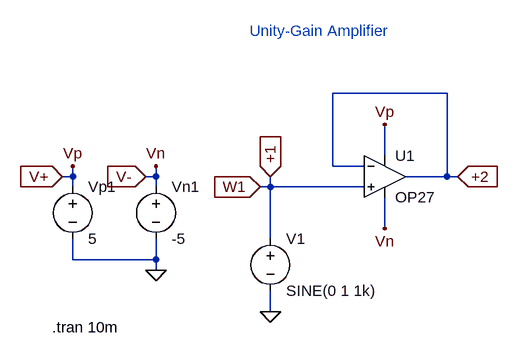
[diagram p0: schematic unity_gain_amp.asc]
unity_gain_amp.asc, the LTspice schematic file:
Version 4
SHEET 1 880 680
WIRE 480 0 304 0
WIRE 384 96 384 48
WIRE 304 112 304 0
WIRE 352 112 304 112
WIRE -96 128 -96 112
WIRE -96 128 -112 128
WIRE 32 128 32 112
WIRE 32 128 16 128
WIRE 480 128 480 0
WIRE 480 128 416 128
WIRE 496 128 480 128
WIRE -96 144 -96 128
WIRE 32 144 32 128
WIRE 208 144 208 128
WIRE 208 144 192 144
WIRE 352 144 208 144
WIRE 384 208 384 160
WIRE 208 224 208 144
WIRE -96 256 -96 224
WIRE 32 256 32 224
WIRE 32 256 -96 256
WIRE 32 272 32 256
WIRE 208 336 208 304
FLAG 208 336 0
FLAG 32 272 0
FLAG -96 112 Vp
FLAG 32 112 Vn
FLAG 384 208 Vn
FLAG 384 48 Vp
FLAG 192 144 W1
IOPIN 192 144 In
FLAG 208 128 +1
IOPIN 208 128 In
FLAG 496 128 +2
IOPIN 496 128 In
FLAG -112 128 V+
IOPIN -112 128 In
FLAG 16 128 V-
IOPIN 16 128 In
SYMBOL voltage 208 208 R0
WINDOW 123 0 0 Left 0
WINDOW 39 0 0 Left 0
SYMATTR InstName V1
SYMATTR Value SINE(0 1 1k)
SYMBOL voltage -96 128 R0
WINDOW 123 0 0 Left 0
WINDOW 39 0 0 Left 0
SYMATTR InstName Vp1
SYMATTR Value 5
SYMBOL voltage 32 128 R0
WINDOW 123 0 0 Left 0
WINDOW 39 0 0 Left 0
SYMATTR InstName Vn1
SYMATTR Value -5
SYMBOL Opamps\\OP27 384 64 R0
SYMATTR InstName U1
TEXT -128 360 Left 2 !.tran 10m
TEXT 176 -96 Left 2 ;Unity-Gain Amplifier

The netlist it stands for:
* unity_gain_amp.asc
V1 +1 0 SINE(0 1 1k)
Vp1 V+ 0 5
Vn1 V- 0 -5
XU1 +1 +2 V+ V- +2 OP27  ; pins In+ In- V+ V- OUT
.tran 10m
* Unity-Gain Amplifier
.lib ADI.lib
.backanno
.end